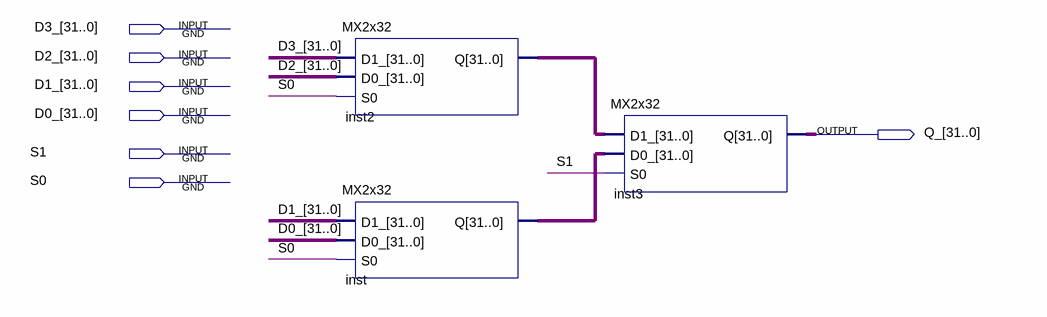
[diagram p0: schematic sheet]
// Quartus schematic MX4x32.bdf as structural Verilog: 3 symbols, 7 pins
module MX4x32 (
  input  [31:0] D3_,
  input  [31:0] D2_,
  input  [31:0] D1_,
  input  [31:0] D0_,
  input  S1,
  input  S0,
  output [31:0] Q_
);

  wire [31:0] inst2_q, inst_q;

  MX2x32 inst2 (.D1_(D3_), .D0_(D2_), .S0(S0), .Q(inst2_q));
  MX2x32 inst (.D1_(D1_), .D0_(D0_), .S0(S0), .Q(inst_q));
  MX2x32 inst3 (.D1_(inst2_q), .D0_(inst_q), .S0(S1), .Q(Q_));
endmodule
